# Altium schematic sheet 04 USB.SchDoc
size 420 x 297 mm
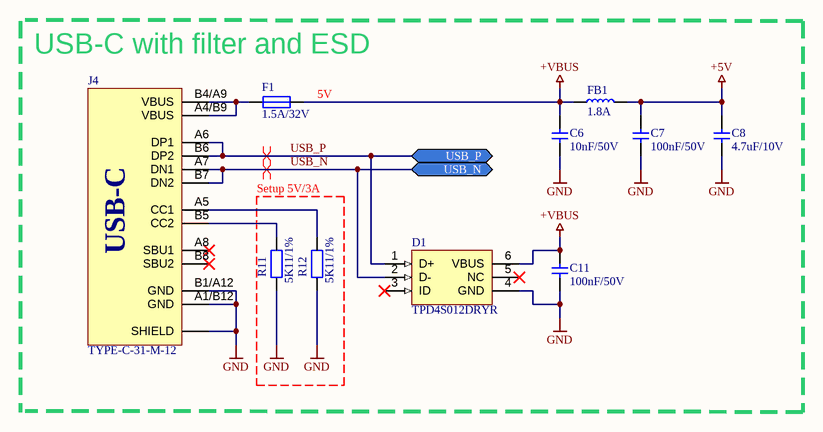
[diagram p0: 04 USB.SchDoc]

## Parts
C6  10nF/50V  [CAPC1005X06N]
C7  100nF/50V  [CAPC1005X06N]
C8  4.7uF/10V  [CAPC1005X06N]
C11  100nF/50V  [CAPC1005X06N]
D1  TPD4S012DRYR  [SON50P100X60-6N]
F1  1.5A/32V  [F0603HI1500V032T]
FB1  1.8A  [INDC1608X10N]
J4  TYPE-C-31-M-12  [TYPE-C-31-M-12]
R11  5K11/1%  [RESC1005X04N]
R12  5K11/1%  [RESC1005X04N]

## Blocks framed on the sheet
Setup 5V/3A: R11 R12

## Ports
USB_N (bidir), USB_P (bidir)

## Nets
+5V: C7.2 C8.2 FB1.2
+VBUS: C6.2 C11.2 D1.6(VBUS) F1.2 FB1.1
GND: C6.1 C7.1 C8.1 C11.1 D1.4(GND) J4.A1/B12(GND) J4.B1/A12(GND) J4.SHIELD R11.1 R12.1
USB_N: D1.2(D-) J4.A7(DN1) J4.B7(DN2) ; port USB_N
USB_P: D1.1(D+) J4.A6(DP1) J4.B6(DP2) ; port USB_P
NetF1_1: F1.1 J4.A4/B9(VBUS) J4.B4/A9(VBUS)
NetJ4_A5: J4.A5(CC1) R12.2
NetJ4_B5: J4.B5(CC2) R11.2

Not connected (* = marked no-connect by the designer): D1 3(ID)* 5(NC)*; J4 A8(SBU1)* B8(SBU2)*

## Layout directives
differential pair; differential pair class USB; net class USB: USB_N, USB_P

## Notes on the sheet
- USB-C with filter and ESD
- (near F1) 5V
- Title
- Project
- Size
- Date
- Revision
- A3
- (in symbol TYPE-C-31-M-12) USB-C

## Library data of the parts
C6 = CL05B103KB5NNNC: 50V 10nF X7R ±10% 0402  Multilayer Ceramic Capacitors MLCC - SMD/SMT ROHS; manufacturer: Samsung Electro-Mechanics; assembler_number: C15195; mfr_part_number: CL05B103KB5NNNC; datasheet: https://datasheet.lcsc.com/lcsc/1810191223_Samsung-Electro-Mechanics-CL05B103KB5NNNC_C15195.pdf
C7 C11 = CL05B104KO5NNNC: 16V 100nF X7R ±10% 0402  Multilayer Ceramic Capacitors MLCC - SMD/SMT ROHS; manufacturer: Samsung Electro-Mechanics; assembler_number: C1525; mfr_part_number: CL05B104KO5NNNC; datasheet: https://datasheet.lcsc.com/lcsc/1810191219_Samsung-Electro-Mechanics-CL05B104KO5NNNC_C1525.pdf
C8 = CL05A475MP5NRNC: 10V 4.7uF X5R ±20% 0402  Multilayer Ceramic Capacitors MLCC - SMD/SMT ROHS; manufacturer: Samsung Electro-Mechanics; assembler_number: C23733; mfr_part_number: CL05A475MP5NRNC; datasheet: https://datasheet.lcsc.com/lcsc/1810191211_Samsung-Electro-Mechanics-CL05A475MP5NRNC_C23733.pdf
D1 = TPD4S012DRYR: 3A 5.5V 6V Unidirectional SON-6  ESD Protection Devices ROHS; manufacturer: Texas Instruments; assembler_number: C96506; mfr_part_number: TPD4S012DRYR; datasheet: https://www.ti.com/cn/lit/gpn/tpd4s012
F1 = F0603HI1500V032T: 50A SMD Ceramic Fuse 1.5A 0.11 101mΩ 0603  Fuses ROHS; manufacturer: AEM; assembler_number: C96550; mfr_part_number: F0603HI1500V032T; datasheet: https://datasheet.lcsc.com/lcsc/1810241823_AEM-F0603HI1500V032T_C96550.pdf
FB1 = UPZ1608G300-1R8TF: 1.8A 1 60mΩ 30Ω@100MHz ±25% 0603  Ferrite Beads ROHS; manufacturer: Sunlord; assembler_number: C919159; mfr_part_number: UPZ1608G300-1R8TF; datasheet: https://datasheet.lcsc.com/lcsc/2110100030_Sunlord-UPZ1608G300-1R8TF_C919159.pdf
J4 = TYPE-C-31-M-12: 5A 1 16 Female Type-C SMD  USB Connectors ROHS; manufacturer: Korean Hroparts Elec; assembler_number: C165948; mfr_part_number: TYPE-C-31-M-12; datasheet: https://datasheet.lcsc.com/lcsc/2205251630_Korean-Hroparts-Elec-TYPE-C-31-M-12_C165948.pdf
R11 R12 = RC-02W5111FT: 62.5mW 50V ±1% ±200ppm/℃ -55℃~+155℃ 5.11kΩ 0402  Chip Resistor - Surface Mount ROHS; manufacturer: FH (Guangdong Fenghua Advanced Tech); assembler_number: C310235; mfr_part_number: RC-02W5111FT; datasheet: https://datasheet.lcsc.com/lcsc/1912111437_FH--Guangdong-Fenghua-Advanced-Tech-RC-02W5111FT_C310235.pdf